# Altium schematic sheet dsau-micro-zed-bank34.SchDoc: dSAU Motherboard - uZed BANK34
size Letter; Engineer: Christopher J. Woodall; Organization: Boston University EDF/ECE; DocumentNumber: 8; Revision: A; SheetNumber: 8; SheetTotal: 10; EMAIL: cwoodall@bu.edu; TeamName: Team 19; ProjectName: dSAU
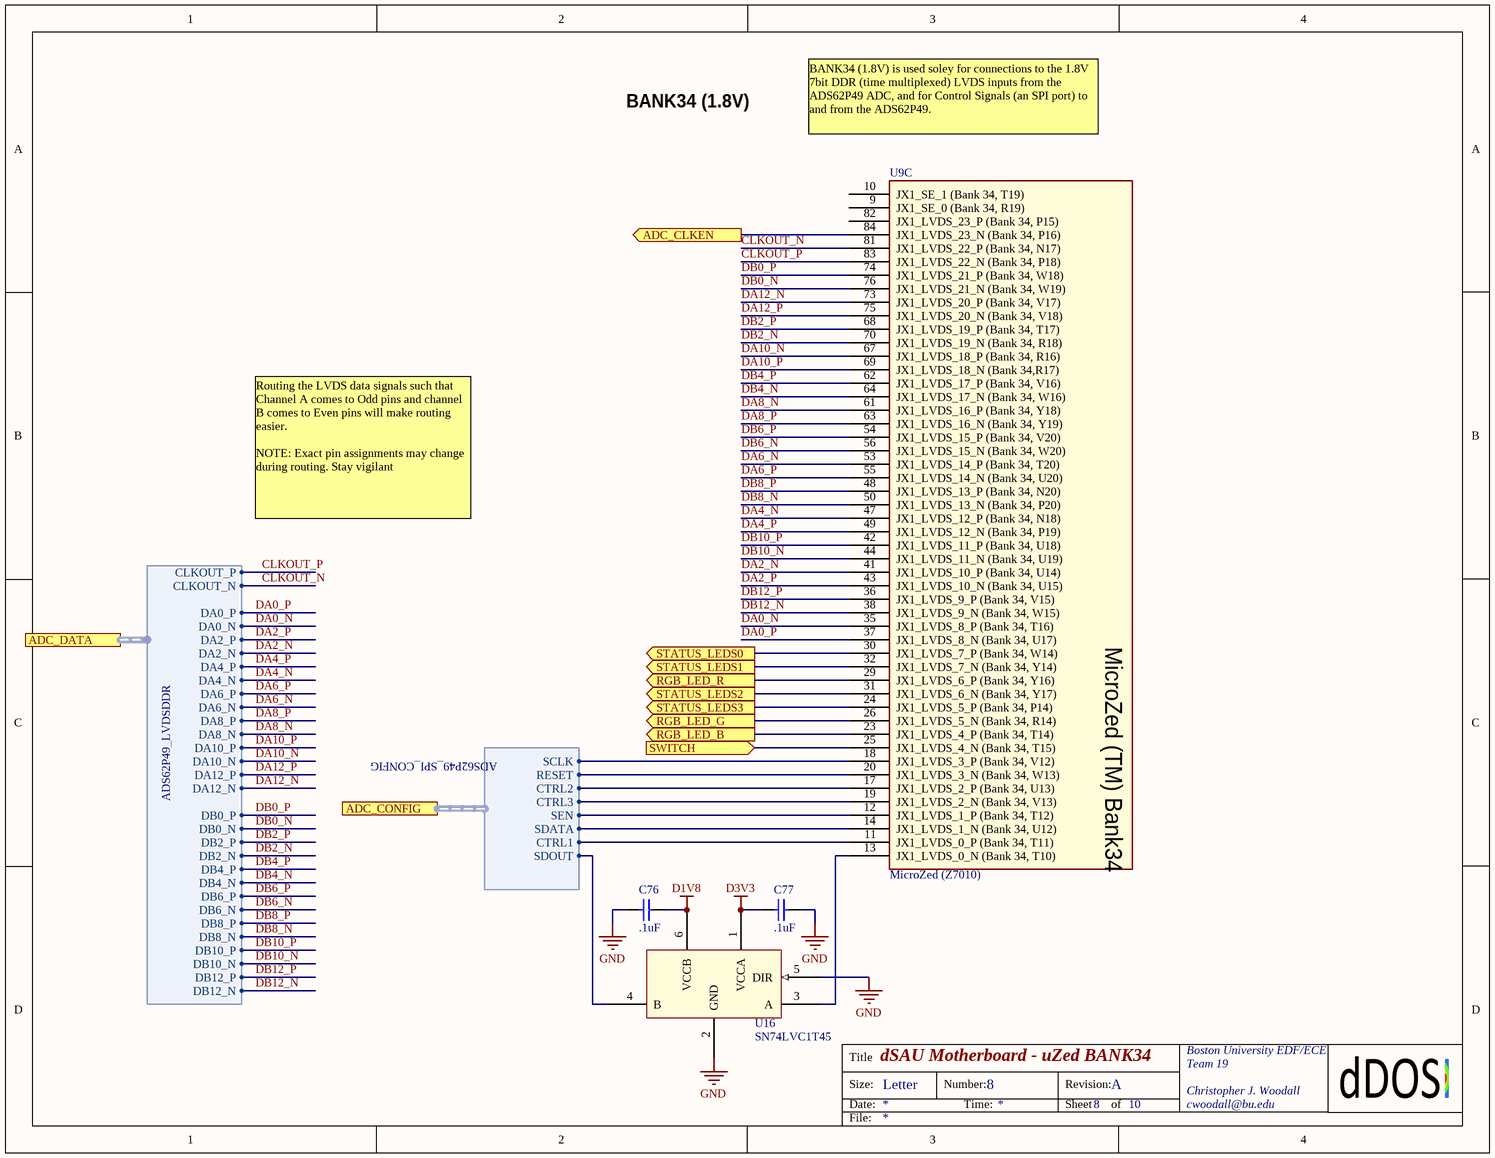
[diagram p0: dsau-micro-zed-bank34.SchDoc]

## Parts
C76  value .1uF  [CAPC1608L]  (hidden comment: CER 0.1UF 50V Y5V)
C77  value .1uF  [CAPC1608L]  (hidden comment: CER 0.1UF 50V Y5V)
U9  MicroZed (Z7010)  [MicroZed_MatingSide]  (part C of 5)
U16  SN74LVC1T45  [SOT23_6_CUSTOM]

## Ports
ADC_CLKEN (out), ADC_CONFIG (harness ADS62P49_SPI_CONFIG), ADC_DATA (harness ADS62P49_LVDSDDR), RGB_LED_B (out), RGB_LED_G (out), RGB_LED_R (out), STATUS_LEDS0 (out), STATUS_LEDS1 (out), STATUS_LEDS2 (out), STATUS_LEDS3 (out), SWITCH (in)

## Harnesses
ADS62P49_LVDSDDR: DA0_N, DA2_N, DA4_N, DA6_N, DA8_N, DA10_N, DA12_N, DA0_P, DA2_P, DA4_P, DA6_P, DA8_P, DA10_P, DA12_P, DB0_N, DB2_N, DB4_N, DB6_N, DB8_N, DB10_N, DB12_N, DB0_P, DB2_P, DB4_P, DB6_P, DB8_P, DB10_P, DB12_P, CLKOUT_P, CLKOUT_N
ADS62P49_SPI_CONFIG: CTRL1, CTRL2, CTRL3, RESET, SCLK, SDATA, SDOUT, SEN

## Nets
D1V8: C76.2 U16.6(VCCB)
D3V3: C77.1 U16.1(VCCA)
GND: C76.1 C77.2 U16.2(GND) U16.5(DIR)
ADC_CLKEN: U9.84(JX1_LVDS_23_N_(Bank_34,_P16)) ; port ADC_CLKEN
CLKOUT_N: U9.81(JX1_LVDS_22_P_(Bank_34,_N17)) ; port ADC_DATA.CLKOUT_N
CLKOUT_P: U9.83(JX1_LVDS_22_N_(Bank_34,_P18)) ; port ADC_DATA.CLKOUT_P
DA0_N: U9.35(JX1_LVDS_8_P_(Bank_34,_T16)) ; port ADC_DATA.DA0_N
DA0_P: U9.37(JX1_LVDS_8_N_(Bank_34,_U17)) ; port ADC_DATA.DA0_P
DA2_N: U9.41(JX1_LVDS_10_P_(Bank_34,_U14)) ; port ADC_DATA.DA2_N
DA2_P: U9.43(JX1_LVDS_10_N_(Bank_34,_U15)) ; port ADC_DATA.DA2_P
DA4_N: U9.47(JX1_LVDS_12_P_(Bank_34,_N18)) ; port ADC_DATA.DA4_N
DA4_P: U9.49(JX1_LVDS_12_N_(Bank_34,_P19)) ; port ADC_DATA.DA4_P
DA6_N: U9.53(JX1_LVDS_14_P_(Bank_34,_T20)) ; port ADC_DATA.DA6_N
DA6_P: U9.55(JX1_LVDS_14_N_(Bank_34,_U20)) ; port ADC_DATA.DA6_P
DA8_N: U9.61(JX1_LVDS_16_P_(Bank_34,_Y18)) ; port ADC_DATA.DA8_N
DA8_P: U9.63(JX1_LVDS_16_N_(Bank_34,_Y19)) ; port ADC_DATA.DA8_P
DA10_N: U9.67(JX1_LVDS_18_P_(Bank_34,_R16)) ; port ADC_DATA.DA10_N
DA10_P: U9.69(JX1_LVDS_18_N_(Bank_34,R17)) ; port ADC_DATA.DA10_P
DA12_N: U9.73(JX1_LVDS_20_P_(Bank_34,_V17)) ; port ADC_DATA.DA12_N
DA12_P: U9.75(JX1_LVDS_20_N_(Bank_34,_V18)) ; port ADC_DATA.DA12_P
DB0_N: U9.76(JX1_LVDS_21_N_(Bank_34,_W19)) ; port ADC_DATA.DB0_N
DB0_P: U9.74(JX1_LVDS_21_P_(Bank_34,_W18)) ; port ADC_DATA.DB0_P
DB2_N: U9.70(JX1_LVDS_19_N_(Bank_34,_R18)) ; port ADC_DATA.DB2_N
DB2_P: U9.68(JX1_LVDS_19_P_(Bank_34,_T17)) ; port ADC_DATA.DB2_P
DB4_N: U9.64(JX1_LVDS_17_N_(Bank_34,_W16)) ; port ADC_DATA.DB4_N
DB4_P: U9.62(JX1_LVDS_17_P_(Bank_34,_V16)) ; port ADC_DATA.DB4_P
DB6_N: U9.56(JX1_LVDS_15_N_(Bank_34,_W20)) ; port ADC_DATA.DB6_N
DB6_P: U9.54(JX1_LVDS_15_P_(Bank_34,_V20)) ; port ADC_DATA.DB6_P
DB8_N: U9.50(JX1_LVDS_13_N_(Bank_34,_P20)) ; port ADC_DATA.DB8_N
DB8_P: U9.48(JX1_LVDS_13_P_(Bank_34,_N20)) ; port ADC_DATA.DB8_P
DB10_N: U9.44(JX1_LVDS_11_N_(Bank_34,_U19)) ; port ADC_DATA.DB10_N
DB10_P: U9.42(JX1_LVDS_11_P_(Bank_34,_U18)) ; port ADC_DATA.DB10_P
DB12_N: U9.38(JX1_LVDS_9_N_(Bank_34,_W15)) ; port ADC_DATA.DB12_N
DB12_P: U9.36(JX1_LVDS_9_P_(Bank_34,_V15)) ; port ADC_DATA.DB12_P
RGB_LED_B: U9.23(JX1_LVDS_4_P_(Bank_34,_T14)) ; port RGB_LED_B
RGB_LED_G: U9.26(JX1_LVDS_5_N_(Bank_34,_R14)) ; port RGB_LED_G
RGB_LED_R: U9.29(JX1_LVDS_6_P_(Bank_34,_Y16)) ; port RGB_LED_R
STATUS_LEDS0: U9.30(JX1_LVDS_7_P_(Bank_34,_W14)) ; port STATUS_LEDS0
STATUS_LEDS1: U9.32(JX1_LVDS_7_N_(Bank_34,_Y14)) ; port STATUS_LEDS1
STATUS_LEDS2: U9.31(JX1_LVDS_6_N_(Bank_34,_Y17)) ; port STATUS_LEDS2
STATUS_LEDS3: U9.24(JX1_LVDS_5_P_(Bank_34,_P14)) ; port STATUS_LEDS3
SWITCH: U9.25(JX1_LVDS_4_N_(Bank_34,_T15)) ; port SWITCH
NetU9_11: U9.11(JX1_LVDS_0_P_(Bank_34,_T11)) ; port ADC_CONFIG.CTRL1
NetU9_12: U9.12(JX1_LVDS_1_P_(Bank_34,_T12)) ; port ADC_CONFIG.SEN
NetU9_13: U9.13(JX1_LVDS_0_N_(Bank_34,_T10)) U16.3(A)
NetU9_14: U9.14(JX1_LVDS_1_N_(Bank_34,_U12)) ; port ADC_CONFIG.SDATA
NetU9_17: U9.17(JX1_LVDS_2_P_(Bank_34,_U13)) ; port ADC_CONFIG.CTRL2
NetU9_18: U9.18(JX1_LVDS_3_P_(Bank_34,_V12)) ; port ADC_CONFIG.SCLK
NetU9_19: U9.19(JX1_LVDS_2_N_(Bank_34,_V13)) ; port ADC_CONFIG.CTRL3
NetU9_20: U9.20(JX1_LVDS_3_N_(Bank_34,_W13)) ; port ADC_CONFIG.RESET
NetU16_4: U16.4(B) ; port ADC_CONFIG.SDOUT

Not connected (* = marked no-connect by the designer): U9 9(JX1_SE_0_(Bank_34,_R19)) 10(JX1_SE_1_(Bank_34,_T19)) 82(JX1_LVDS_23_P_(Bank_34,_P15))

## Notes on the sheet
- BANK34 (1.8V)
- BANK34 (1.8V) is used soley for connections to the 1.8V 7bit DDR (time multiplexed) LVDS inputs from the ADS62P49 ADC, and for Control Signals (an SPI port) to and from the ADS62P49.
- Routing the LVDS data signals such that Channel A comes to Odd pins and channel B comes to Even pins will make routing easier.
  NOTE: Exact pin assignments may change during routing. Stay vigilant
- Title
- Size:
- Date:
- Letter
- Number:
- Time:
- Revision:
- Sheet
- of
- File:
- (in symbol MicroZed, part C) MicroZed (TM) Bank34

## Library data of the parts
C76 C77 = Cap: Capacitor; Manufacturer: Yageo; Manufacturer Part Number: CC0603ZRY5V9BB104; Published: 8-Jun-2000; LatestRevisionDate: 17-Jul-2002; LatestRevisionNote: Re-released for DXP Platform.; PackageReference: RAD-0.3; Publisher: Altium Limited; Supplier 1: Digi-Key; Supplier Part Number 1: 311-1343-1-ND
U9 = MicroZed: MicroZed is a low-cost development board based on the Xilinx Zynq-7000 All Programmable SoC. Its unique design allows it to be used as both a stand-alone evaluation board for basic SoC experimentation, or combined with a carrier card as an embeddable syst; Manufacturer: Avnet; Manfacturer Part Number: AES-Z7MB-7Z010-G; Supplier 1: Avnet; Supplier Part Number 1: AES-Z7MB-7Z010-G; Supplier 2: Mouser; Supplier Part Number 2: 649-61083-101400LF
U16 = SN74LVC1T45: This single-bit noninverting bus transceiver uses two separate configurable power-supply rails. The A port is  designed to track VCCA. VCCA accepts any supply voltage from 1.65 V to 5.5 V. The B port is designed to track  VCCB. VCCB accepts any supply vol; Manufacturer: Texas Instruments; Value: SN74LVC1T45; Manufacturer Part Number: SN74LVC1T45; Supplier 1: Digikey; Supplier Part Number 1: 296-16843-1-ND